# EAGLE design iprobe (EAGLE 6.6.0)
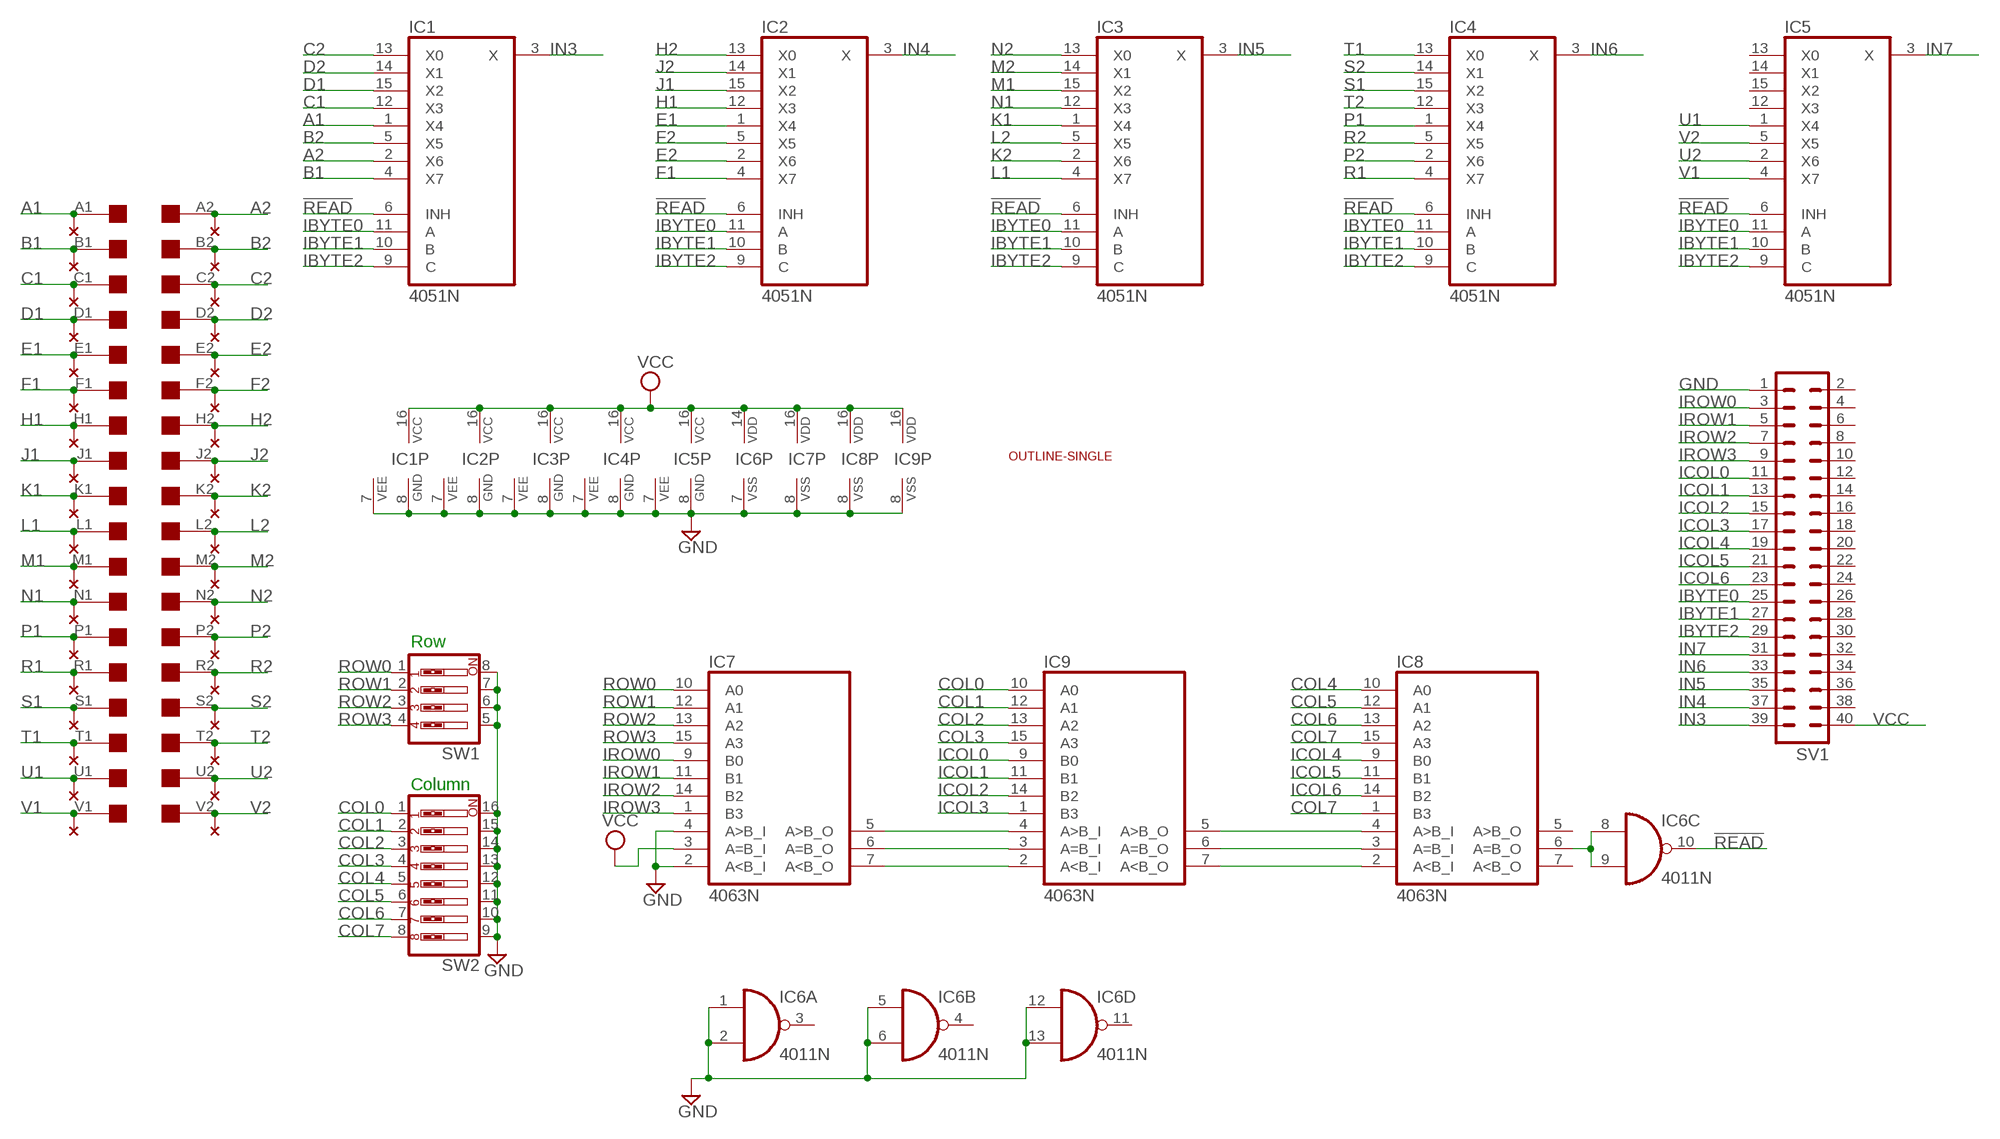
[diagram p0: schematic, sheet 1]

## Parts
EDGE1  EDGE-2CONNECTOR  [EDGE-CON2]
IC1  4051N  [DIL16]
IC2  4051N  [DIL16]
IC3  4051N  [DIL16]
IC4  4051N  [DIL16]
IC5  4051N  [DIL16]
IC6  4011N  [DIL14]
IC7  4063N  [DIL16]
IC8  4063N  [DIL16]
IC9  4063N  [DIL16]
SV1  MA20-2  [MA20-2]
SW1  SW_DIP-4  [EDG-04]
SW2  SW_DIP-8  [EDG-08]
U$2  THRU-HOLE2  [THRU-HOLEB]
U$3  OUTLINE-SINGLE  [SINGLE]

## Nets
!READ: IC1.6(INH) IC2.6(INH) IC3.6(INH) IC4.6(INH) IC5.6(INH) IC6.10(C:O)
A1: EDGE1.A1 IC1.1(X4) U$2.A1
A2: EDGE1.A2 IC1.2(X6) U$2.A2
B1: EDGE1.B1 IC1.4(X7) U$2.B1
B2: EDGE1.B2 IC1.5(X5) U$2.B2
C1: EDGE1.C1 IC1.12(X3) U$2.C1
C2: EDGE1.C2 IC1.13(X0) U$2.C2
COL0: IC9.10(A0) SW2.1
COL1: IC9.12(A1) SW2.2
COL2: IC9.13(A2) SW2.3
COL3: IC9.15(A3) SW2.4
COL4: IC8.10(A0) SW2.5
COL5: IC8.12(A1) SW2.6
COL6: IC8.13(A2) SW2.7
COL7: IC8.1(B3) IC8.15(A3) SW2.8
D1: EDGE1.D1 IC1.15(X2) U$2.D1
D2: EDGE1.D2 IC1.14(X1) U$2.D2
E1: EDGE1.E1 IC2.1(X4) U$2.E1
E2: EDGE1.E2 IC2.2(X6) U$2.E2
F1: EDGE1.F1 IC2.4(X7) U$2.F1
F2: EDGE1.F2 IC2.5(X5) U$2.F2
GND: IC1.7(VEE) IC1.8(GND) IC2.7(VEE) IC2.8(GND) IC3.7(VEE) IC3.8(GND) IC4.7(VEE) IC4.8(GND) IC5.7(VEE) IC5.8(GND) IC6.1(A:I0) IC6.2(A:I1) IC6.5(B:I0) IC6.6(B:I1) IC6.7(P:VSS) IC6.12(D:I0) IC6.13(D:I1) IC7.2(A<B_I) IC7.4(A>B_I) IC7.8(VSS) IC8.8(VSS) IC9.8(VSS) SV1.1 SW1.5 SW1.6 SW1.7 SW1.8 SW2.9 SW2.10 SW2.11 SW2.12 SW2.13 SW2.14 SW2.15 SW2.16
H1: EDGE1.H1 IC2.12(X3) U$2.H1
H2: EDGE1.H2 IC2.13(X0) U$2.H2
IBYTE0: IC1.11(A) IC2.11(A) IC3.11(A) IC4.11(A) IC5.11(A) SV1.25
IBYTE1: IC1.10(B) IC2.10(B) IC3.10(B) IC4.10(B) IC5.10(B) SV1.27
IBYTE2: IC1.9(C) IC2.9(C) IC3.9(C) IC4.9(C) IC5.9(C) SV1.29
ICOL0: IC9.9(B0) SV1.11
ICOL1: IC9.11(B1) SV1.13
ICOL2: IC9.14(B2) SV1.15
ICOL3: IC9.1(B3) SV1.17
ICOL4: IC8.9(B0) SV1.19
ICOL5: IC8.11(B1) SV1.21
ICOL6: IC8.14(B2) SV1.23
IN3: IC1.3(X) SV1.39
IN4: IC2.3(X) SV1.37
IN5: IC3.3(X) SV1.35
IN6: IC4.3(X) SV1.33
IN7: IC5.3(X) SV1.31
IROW0: IC7.9(B0) SV1.3
IROW1: IC7.11(B1) SV1.5
IROW2: IC7.14(B2) SV1.7
IROW3: IC7.1(B3) SV1.9
J1: EDGE1.J1 IC2.15(X2) U$2.J1
J2: EDGE1.J2 IC2.14(X1) U$2.J2
K1: EDGE1.K1 IC3.1(X4) U$2.K1
K2: EDGE1.K2 IC3.2(X6) U$2.K2
L1: EDGE1.L1 IC3.4(X7) U$2.L1
L2: EDGE1.L2 IC3.5(X5) U$2.L2
M1: EDGE1.M1 IC3.15(X2) U$2.M1
M2: EDGE1.M2 IC3.14(X1) U$2.M2
N1: EDGE1.N1 IC3.12(X3) U$2.N1
N2: EDGE1.N2 IC3.13(X0) U$2.N2
N$1: IC7.5(A>B_O) IC9.4(A>B_I)
N$2: IC7.6(A=B_O) IC9.3(A=B_I)
N$3: IC7.7(A<B_O) IC9.2(A<B_I)
N$4: IC6.8(C:I0) IC6.9(C:I1) IC8.6(A=B_O)
N$5: IC8.4(A>B_I) IC9.5(A>B_O)
N$6: IC8.3(A=B_I) IC9.6(A=B_O)
N$7: IC8.2(A<B_I) IC9.7(A<B_O)
P1: EDGE1.P1 IC4.1(X4) U$2.P1
P2: EDGE1.P2 IC4.2(X6) U$2.P2
R1: EDGE1.R1 IC4.4(X7) U$2.R1
R2: EDGE1.R2 IC4.5(X5) U$2.R2
ROW0: IC7.10(A0) SW1.1
ROW1: IC7.12(A1) SW1.2
ROW2: IC7.13(A2) SW1.3
ROW3: IC7.15(A3) SW1.4
S1: EDGE1.S1 IC4.15(X2) U$2.S1
S2: EDGE1.S2 IC4.14(X1) U$2.S2
T1: EDGE1.T1 IC4.13(X0) U$2.T1
T2: EDGE1.T2 IC4.12(X3) U$2.T2
U1: EDGE1.U1 IC5.1(X4) U$2.U1
U2: EDGE1.U2 IC5.2(X6) U$2.U2
V1: EDGE1.V1 IC5.4(X7) U$2.V1
V2: EDGE1.V2 IC5.5(X5) U$2.V2
VCC: IC1.16(VCC) IC2.16(VCC) IC3.16(VCC) IC4.16(VCC) IC5.16(VCC) IC6.14(P:VDD) IC7.3(A=B_I) IC7.16(VDD) IC8.16(VDD) IC9.16(VDD) SV1.40
Unconnected: IC5.12(X3) IC5.13(X0) IC5.14(X1) IC5.15(X2) IC6.3(A:O) IC6.4(B:O) IC6.11(D:O) IC8.5(A>B_O) IC8.7(A<B_O) SV1.2 SV1.4 SV1.6 SV1.8 SV1.10 SV1.12 SV1.14 SV1.16 SV1.18 SV1.20 SV1.22 SV1.24 SV1.26 SV1.28 SV1.30 SV1.32 SV1.34 SV1.36 SV1.38

## Notes on the sheet
- Row
- Column

## Library data of the parts
EDGE1 = dec-con:EDGE-2: Double-Sided DEC edge connector.
IC1-IC5 = 40xx:4051: 8-channel ANALOG MULTIPLEXER
IC6 = 40xx:4011: Quad 2-input NAND
IC7-IC9 = 40xx:4063: 4-bit magnitude COMPARATOR
SV1 = con-lstb:MA20-2: PIN HEADER; OC_FARNELL: unknown; OC_NEWARK: unknown
SW1 = special:SW_DIP-4: DIP SWITCH
SW2 = special:SW_DIP-8: DIP SWITCH
U$2 = dec-con:THRU-HOLE2: Thru-Hole addition to double-sided edge connector.
U$3 = dec-con:OUTLINE-*: Board outlines for DEC boards.

## Board
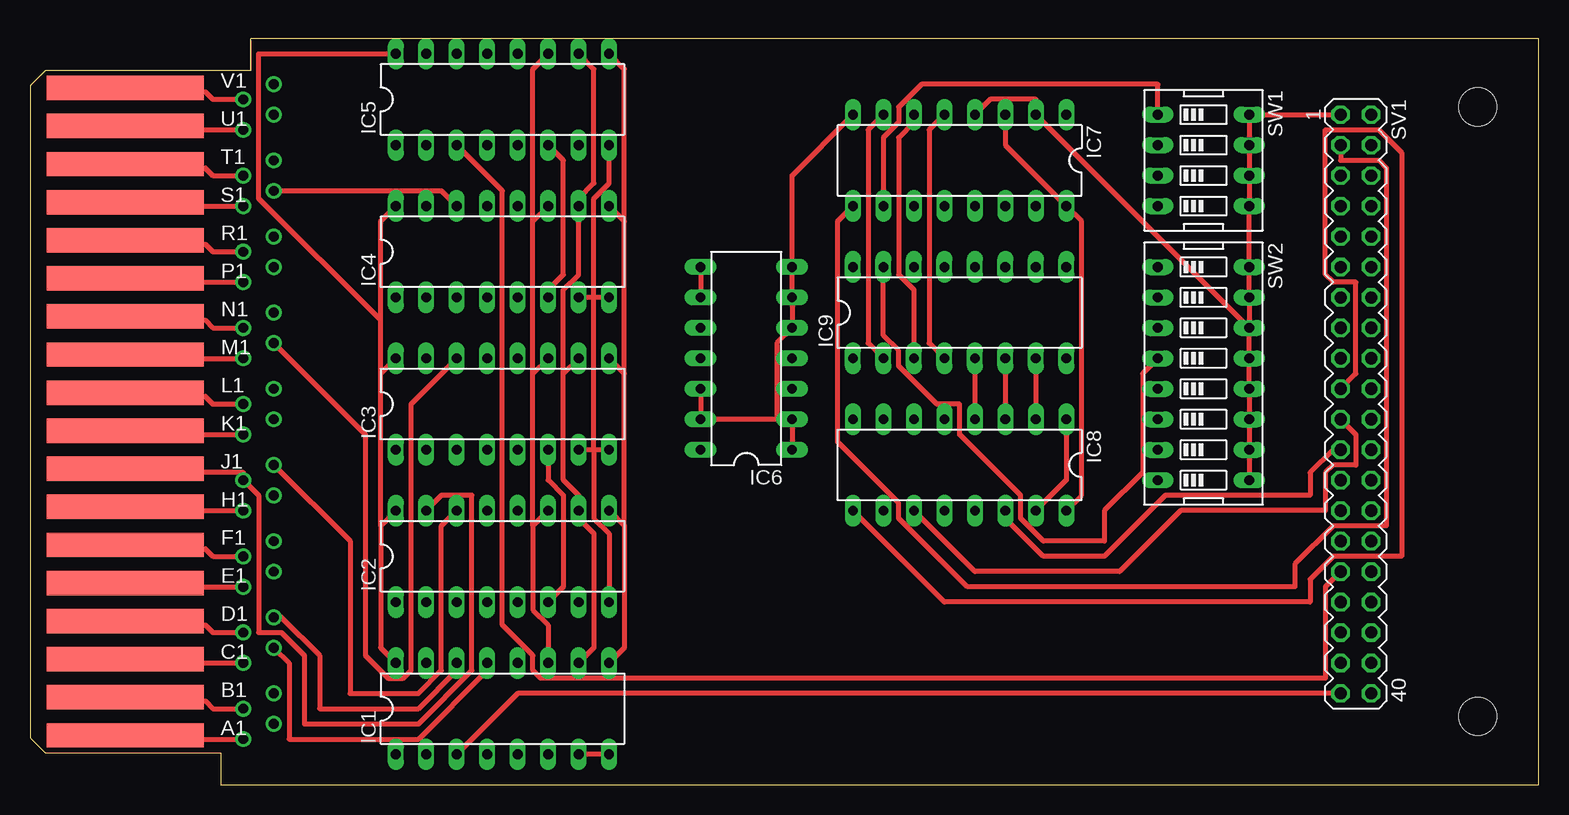
[diagram p1: board, top side]
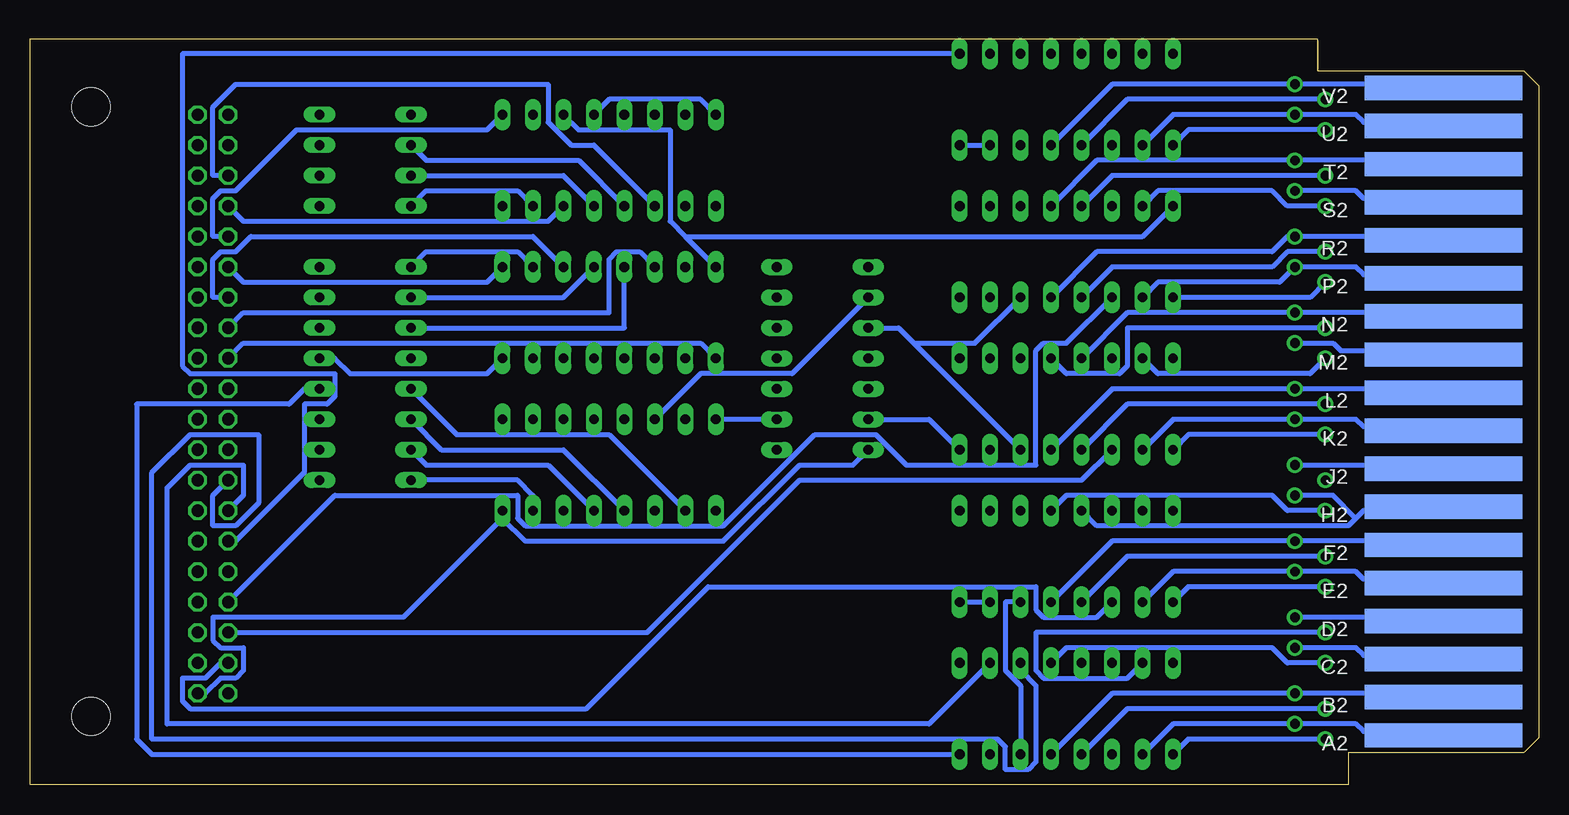
[diagram p2: board, bottom side, seen from below]

Size 125.73 x 62.23 mm. Coordinates in mm from the lower left corner, seen from the top.
Copper layers (1+16): Top 0.035mm / dielectric 1.5mm / Bottom 0.035mm
Design rules "16mils": minimum track width 16mil, minimum drill 32mil, track to track 15mil, track to pad 10mil, pad to pad 10mil, via to via 10mil, smd to smd 10mil, copper to edge 13mil, drill to drill 10mil, minimum pad ring 10mil, minimum via ring 8mil, stop-mask expansion 0mil, vias tented up to drill 0mil, thermal gap 10mil

### Footprints (pad centres in the part's own frame; a part is rotated, then mirrored left to right if it is on the bottom)
EDGE-CON2 = smd 13.106 x 2.032: A1 7.938,4.128; B1 7.938,7.303; C1 7.938,10.477; D1 7.938,13.652; E1 7.938,16.828; F1 7.938,20.003; H1 7.938,23.177; J1 7.938,26.352; K1 7.938,29.527; L1 7.938,32.703; M1 7.938,35.877; N1 7.938,39.053; P1 7.938,42.227; R1 7.938,45.403; S1 7.938,48.578; T1 7.938,51.752; U1 7.938,54.928; V1 7.938,58.102 | smd 13.106 x 2.032 bottom: A2 7.938,4.128; B2 7.938,7.303; C2 7.938,10.477; D2 7.938,13.652; E2 7.938,16.828; F2 7.938,20.003; H2 7.938,23.177; J2 7.938,26.352; K2 7.938,29.527; L2 7.938,32.703; M2 7.938,35.877; N2 7.938,39.053; P2 7.938,42.227; R2 7.938,45.403; S2 7.938,48.578; T2 7.938,51.752; U2 7.938,54.928; V2 7.938,58.102
DIL16 = drill 0.813 long: 1 -8.89,-3.81; 2 -6.35,-3.81; 3 -3.81,-3.81; 4 -1.27,-3.81; 5 1.27,-3.81; 6 3.81,-3.81; 7 6.35,-3.81; 8 8.89,-3.81; 9 8.89,3.81; 10 6.35,3.81; 11 3.81,3.81; 12 1.27,3.81; 13 -1.27,3.81; 14 -3.81,3.81; 15 -6.35,3.81; 16 -8.89,3.81
DIL14 = drill 0.813 long: 1 -7.62,-3.81; 2 -5.08,-3.81; 3 -2.54,-3.81; 4 0,-3.81; 5 2.54,-3.81; 6 5.08,-3.81; 7 7.62,-3.81; 8 7.62,3.81; 9 5.08,3.81; 10 2.54,3.81; 11 0,3.81; 12 -2.54,3.81; 13 -5.08,3.81; 14 -7.62,3.81
MA20-2 = drill 1.016 octagon: 1 -24.13,-1.27; 2 -24.13,1.27; 3 -21.59,-1.27; 4 -21.59,1.27; 5 -19.05,-1.27; 6 -19.05,1.27; 7 -16.51,-1.27; 8 -16.51,1.27; 9 -13.97,-1.27; 10 -13.97,1.27; 11 -11.43,-1.27; 12 -11.43,1.27; 13 -8.89,-1.27; 14 -8.89,1.27; 15 -6.35,-1.27; 16 -6.35,1.27; 17 -3.81,-1.27; 18 -3.81,1.27; 19 -1.27,-1.27; 20 -1.27,1.27; 21 1.27,-1.27; 22 1.27,1.27; 23 3.81,-1.27; 24 3.81,1.27; 25 6.35,-1.27; 26 6.35,1.27; 27 8.89,-1.27; 28 8.89,1.27; 29 11.43,-1.27; 30 11.43,1.27; 31 13.97,-1.27; 32 13.97,1.27; 33 16.51,-1.27; 34 16.51,1.27; 35 19.05,-1.27; 36 19.05,1.27; 37 21.59,-1.27; 38 21.59,1.27; 39 24.13,-1.27; 40 24.13,1.27
EDG-04 = drill 0.813 long: 1 -3.81,-3.81; 2 -1.27,-3.81; 3 1.27,-3.81; 4 3.81,-3.81; 5 3.81,3.81; 6 1.27,3.81; 7 -1.27,3.81; 8 -3.81,3.81
EDG-08 = drill 0.813 long: 1 -8.89,-3.81; 2 -6.35,-3.81; 3 -3.81,-3.81; 4 -1.27,-3.81; 5 1.27,-3.81; 6 3.81,-3.81; 7 6.35,-3.81; 8 8.89,-3.81; 9 8.89,3.81; 10 6.35,3.81; 11 3.81,3.81; 12 1.27,3.81; 13 -1.27,3.81; 14 -3.81,3.81; 15 -6.35,3.81; 16 -8.89,3.81
THRU-HOLEB = drill 0.813 pad 1.27: A1 17.78,3.81; A2 20.32,5.08; B1 17.78,6.35; B2 20.32,7.62; C1 17.78,10.16; C2 20.32,11.43; D1 17.78,12.7; D2 20.32,13.97; E1 17.78,16.51; E2 20.32,17.78; F1 17.78,19.05; F2 20.32,20.32; H1 17.78,22.86; H2 20.32,24.13; J1 17.78,25.4; J2 20.32,26.67; K1 17.78,29.21; K2 20.32,30.48; L1 17.78,31.75; L2 20.32,33.02; M1 17.78,35.56; M2 20.32,36.83; N1 17.78,38.1; N2 20.32,39.37; P1 17.78,41.91; P2 20.32,43.18; R1 17.78,44.45; R2 20.32,45.72; S1 17.78,48.26; S2 20.32,49.53; T1 17.78,50.8; T2 20.32,52.07; U1 17.78,54.61; U2 20.32,55.88; V1 17.78,57.15; V2 20.32,58.42
SINGLE = hole 3.175: 120.65,56.515; 120.65,5.715

### Placement (x,y rotation side)
EDGE1  0,0 0 top
IC1  39.37,6.35 0 top
IC2  39.37,19.05 0 top
IC3  39.37,31.75 0 top
IC4  39.37,44.45 0 top
IC5  39.37,57.15 0 top
IC6  59.69,35.56 90 top
IC7  77.47,52.07 180 top
IC8  77.47,26.67 180 top
IC9  77.47,39.37 0 top
SV1  110.49,31.75 270 top
SW1  97.79,52.07 270 top
SW2  97.79,34.29 270 top
U$2  0,0 0 top
U$3  0,0 0 top

### Tracks (layer width: path | path; a pad name or v marks a point on that pad's centre or on a via)
!READ
  Top 0.406: IC5.6 44.45,52.07 44.45,42.55 43.18,41.27 IC4.6 | IC2.6 44.45,16.51 44.45,24.13 43.18,25.4 IC3.6
  Bottom 0.406: IC1.6 43.18,8.26 44.45,9.53 44.45,15.24 IC2.6 | 52.07,36.83 53.34,38.1 IC6.10 | 52.07,36.83 IC3.6 | IC4.6 46.99,36.83 52.07,36.83
A1
  Top 0.406: U$2.A1 8.26,3.81 EDGE1.A1
  Bottom 0.406: IC1.1 29.21,3.81 U$2.A1
A2
  Bottom 0.406: IC1.2 30.48,5.08 U$2.A2 15.24,5.08 14.61,4.45 8.26,4.45 EDGE1.A2
B1
  Top 0.406: U$2.B1 15.24,6.35 14.61,6.99 8.26,6.99 EDGE1.B1
  Bottom 0.406: IC1.4 34.29,6.35 U$2.B1
B2
  Bottom 0.406: IC1.5 35.56,7.62 U$2.B2 8.26,7.62 EDGE1.B2
C1
  Top 0.406: U$2.C1 8.26,10.16 EDGE1.C1
  Bottom 0.406: IC1.12 39.37,11.43 22.23,11.43 20.96,10.16 U$2.C1
C2
  Top 0.406: IC1.13 38.1,9.53 32.39,3.81 21.59,3.81 21.59,10.16 U$2.C2
  Bottom 0.406: U$2.C2 15.24,11.43 14.61,10.79 8.26,10.79 EDGE1.C2
COL0
  Bottom 0.406: IC9.10 85.09,44.45 92.71,44.45 SW2.1
COL1
  Bottom 0.406: IC9.12 81.28,40.64 SW2.2
COL2
  Bottom 0.406: IC9.13 76.2,38.1 SW2.3
COL3
  Top 0.406: IC9.15 71.12,37.47 72.39,36.2 72.39,34.92 75.57,31.75 77.47,31.75 77.47,29.21 82.55,24.13 82.55,22.23 84.46,20.32 89.54,20.32 89.54,22.86 92.71,26.04 92.71,34.29 SW2.4
COL4
  Bottom 0.406: IC8.10 77.47,29.21 90.17,29.21 SW2.5
COL5
  Bottom 0.406: IC8.12 81.28,27.94 91.44,27.94 SW2.6
COL6
  Bottom 0.406: IC8.13 82.55,26.67 92.71,26.67 SW2.7
COL7
  Top 0.406: IC8.15 86.36,25.4 IC8.1
  Bottom 0.406: SW2.8 85.09,25.4 83.82,24.13 IC8.15
D1
  Top 0.406: U$2.D1 15.24,12.7 14.61,13.34 8.26,13.34 EDGE1.D1
  Bottom 0.406: IC1.15 34.29,8.89 41.28,8.89 41.91,9.53 41.91,12.7 U$2.D1
D2
  Top 0.406: IC1.14 35.56,9.53 32.39,6.35 24.13,6.35 24.13,10.79 20.96,13.97 U$2.D2
  Bottom 0.406: U$2.D2 8.26,13.97 EDGE1.D2
E1
  Top 0.406: U$2.E1 8.26,16.51 EDGE1.E1
  Bottom 0.406: IC2.1 29.21,16.51 U$2.E1
E2
  Bottom 0.406: IC2.2 30.48,17.78 U$2.E2 15.24,17.78 14.61,17.14 8.26,17.14 EDGE1.E2
F1
  Top 0.406: U$2.F1 15.24,19.05 14.61,19.68 8.26,19.68 EDGE1.F1
  Bottom 0.406: IC2.4 34.29,19.05 U$2.F1
F2
  Bottom 0.406: IC2.5 35.56,20.32 U$2.F2 8.26,20.32 EDGE1.F2
GND
  Top 0.406: IC4.8 46.99,40.64 | 46.99,40.64 IC4.7 | IC3.8 46.99,27.94 | 46.99,27.94 IC3.7 | IC2.8 48.26,20.95 46.99,22.23 46.99,27.94 | 46.99,27.94 46.99,40.64 | IC5.8 48.26,50.16 46.99,48.9 46.99,40.64 | IC6.12 IC6.13 62.23,30.48 | IC6.1 IC6.2 62.23,30.48 | IC7.4 80.01,57.15 83.82,57.15 IC7.2 SW2.14 | IC7.8 63.5,50.8 IC6.7 IC6.6 IC6.5 62.23,36.83 62.23,30.48 | SV1.1 SW1.8 SW1.7 SW1.6 SW1.5 SW2.16 SW2.15 SW2.14 | SW2.14 SW2.13 SW2.12 SW2.11 SW2.10 SW2.9 | IC1.8 IC1.7
  Bottom 0.406: IC5.8 IC5.7 | IC2.8 IC2.7 | IC6.2 IC8.8 | IC7.4 77.47,57.15 69.85,57.15 IC7.8 | IC3.8 50.8,30.48 IC6.13 | IC9.8 87.63,34.29 99.06,34.29 100.33,35.56 SW2.13 | IC1.8 115.57,2.54 116.84,3.81 116.84,31.75 104.14,31.75 102.87,33.02 SW2.12
H1
  Top 0.406: U$2.H1 8.26,22.86 EDGE1.H1
  Bottom 0.406: IC2.12 39.37,24.13 22.23,24.13 20.96,22.86 U$2.H1
H2
  Bottom 0.406: IC2.13 36.83,21.59 15.88,21.59 15.24,22.23 | 15.24,22.23 14.61,22.86 8.26,22.86 EDGE1.H2 | U$2.H2 17.15,24.13 15.24,22.23
IBYTE0
  Top 0.406: IC1.11 43.18,13.34 41.91,14.61 41.91,21.59 | IC2.11 41.91,21.59 | 41.91,34.29 IC3.11 | 41.91,21.59 41.91,34.29 | 41.91,46.99 IC4.11 | 41.91,34.29 41.91,46.99 | IC5.11 41.91,59.69 41.91,46.99
  Bottom 0.406: SV1.25 110.49,24.13 110.49,21.59 108.59,21.59 106.68,23.5 106.68,29.21 112.4,29.21 115.57,26.04 115.57,3.81 45.09,3.81 44.45,3.17 44.45,1.27 42.55,1.27 41.91,1.91 41.91,8.26 43.18,9.53 IC1.11
IBYTE1
  Top 0.406: IC1.10 46.99,11.43 46.99,20.95 45.72,22.23 IC2.10 45.72,24.13 44.45,25.4 44.45,34.29 | 44.45,34.29 IC3.10 | 44.45,34.29 44.45,41.27 45.72,42.55 IC4.10 45.72,48.9 46.99,50.16 46.99,59.69 IC5.10
  Bottom 0.406: SV1.27 107.95,24.13 107.95,26.67 112.4,26.67 114.3,24.77 114.3,5.08 50.8,5.08 IC1.10
IBYTE2
  Top 0.406: IC1.9 49.53,11.43 49.53,21.59 | IC2.9 49.53,21.59 | 49.53,34.29 IC3.9 | 49.53,21.59 49.53,34.29 | 49.53,46.99 IC4.9 | 49.53,34.29 49.53,46.99 | IC5.9 49.53,59.69 49.53,46.99
  Bottom 0.406: SV1.29 108.59,20.32 102.87,26.04 102.87,31.75 100.97,31.75 100.33,32.38 100.33,34.29 112.4,34.29 113.03,34.92 113.03,60.96 IC5.9
ICOL0
  Bottom 0.406: IC9.9 87.63,41.91 107.95,41.91 SV1.11
ICOL1
  Bottom 0.406: IC9.11 83.82,45.72 107.32,45.72 108.59,44.45 109.86,44.45 110.49,43.81 110.49,40.64 SV1.13
ICOL2
  Bottom 0.406: IC9.14 74.93,44.45 76.84,44.45 77.47,43.81 77.47,39.37 107.95,39.37 SV1.15
ICOL3
  Bottom 0.406: IC9.1 69.85,36.83 107.95,36.83 SV1.17
ICOL4
  Top 0.406: IC8.9 76.2,15.24 106.68,15.24 106.68,17.14 108.59,19.05 114.3,19.05 114.3,52.7 112.4,54.61 107.95,54.61 107.95,42.55 108.59,41.91 110.49,41.91 110.49,34.29 SV1.19
ICOL5
  Top 0.406: IC8.11 78.74,17.78 90.81,17.78 95.89,22.86 107.95,22.86 107.95,26.04 108.59,26.67 110.49,26.67 110.49,29.21 SV1.21
ICOL6
  Top 0.406: IC8.14 81.28,22.23 84.46,19.05 89.54,19.05 94.62,24.13 106.68,24.13 106.68,26.04 108.59,27.94 SV1.23
IN3
  Top 0.406: IC1.3 40.64,7.62 SV1.39
IN4
  Bottom 0.406: IC2.3 36.83,13.97 41.28,13.97 41.91,14.61 41.91,16.51 69.22,16.51 79.38,6.35 112.4,6.35 113.03,6.99 113.03,8.89 111.13,8.89 109.86,10.16 SV1.37
IN5
  Bottom 0.406: IC3.3 38.1,25.4 61.6,25.4 74.3,12.7 SV1.35
IN6
  Bottom 0.406: IC4.3 39.37,36.83 41.28,36.83 41.91,36.2 41.91,26.67 52.71,26.67 55.25,29.21 60.33,29.21 67.95,21.59 84.46,21.59 85.09,22.23 85.09,24.13 100.33,24.13 SV1.33
IN7
  Top 0.406: IC5.3 39.37,49.53 39.37,13.34 41.91,10.79 41.91,9.53 42.55,8.89 107.95,8.89 107.95,16.51 SV1.31
IROW0
  Top 0.406: IC7.9 67.31,46.99 67.31,28.57 72.39,23.5 72.39,22.23 78.11,16.51 105.41,16.51 105.41,18.41 108.59,21.59 113.03,21.59 113.03,51.44 112.4,52.07 109.22,52.07 SV1.3
IROW1
  Bottom 0.406: IC7.11 78.74,53.34 80.65,53.34 82.55,55.24 82.55,58.42 108.59,58.42 110.49,56.52 110.49,50.8 SV1.5
IROW2
  Bottom 0.406: IC7.14 82.55,46.99 107.95,46.99 SV1.7
IROW3
  Bottom 0.406: IC7.1 87.63,54.61 103.51,54.61 108.59,49.53 109.86,49.53 110.49,48.9 110.49,45.72 SV1.9
J1
  Top 0.406: IC2.15 34.29,24.13 36.83,24.13 36.83,9.53 32.39,5.08 22.86,5.08 22.86,10.79 20.96,12.7 19.05,12.7 19.05,24.13 U$2.J1 17.78,26.04 8.26,26.04 EDGE1.J1
J2
  Top 0.406: IC2.14 34.29,21.59 34.29,9.53 32.39,7.62 26.67,7.62 26.67,20.32 U$2.J2
  Bottom 0.406: U$2.J2 8.26,26.67 EDGE1.J2
K1
  Top 0.406: U$2.K1 8.26,29.21 EDGE1.K1
  Bottom 0.406: IC3.1 29.21,29.21 U$2.K1
K2
  Bottom 0.406: IC3.2 30.48,30.48 U$2.K2 15.24,30.48 14.61,29.84 8.26,29.84 EDGE1.K2
L1
  Top 0.406: U$2.L1 15.24,31.75 14.61,32.38 8.26,32.38 EDGE1.L1
  Bottom 0.406: IC3.4 34.29,31.75 U$2.L1
L2
  Bottom 0.406: IC3.5 35.56,33.02 U$2.L2 8.26,33.02 EDGE1.L2
M1
  Top 0.406: U$2.M1 8.26,35.56 EDGE1.M1
  Bottom 0.406: IC3.15 31.75,34.29 19.05,34.29 U$2.M1
M2
  Top 0.406: IC3.14 31.75,31.75 31.75,9.53 31.12,8.89 29.85,8.89 27.94,10.79 27.94,29.21 U$2.M2
  Bottom 0.406: U$2.M2 17.15,36.83 16.51,36.2 8.26,36.2 EDGE1.M2
N1
  Top 0.406: U$2.N1 15.24,38.1 14.61,38.73 8.26,38.73 EDGE1.N1
  Bottom 0.406: IC3.12 39.37,34.29 34.93,34.29 34.29,34.92 34.29,38.1 U$2.N1
N2
  Bottom 0.406: IC3.13 34.29,39.37 U$2.N2 8.26,39.37 EDGE1.N2
N$1
  Top 0.406: IC9.4 74.93,36.83 74.93,54.61 IC7.5
N$2
  Top 0.406: IC9.3 73.66,41.27 72.39,42.55 72.39,53.98 73.66,55.24 IC7.6
N$3
  Top 0.406: IC9.2 69.85,36.83 69.85,54.61 IC7.7
N$4
  Top 0.406: IC6.8 IC6.9
  Bottom 0.406: IC8.6 69.85,34.29 62.23,34.29 IC6.9
N$5
  Top 0.406: IC9.5 IC8.4
N$6
  Top 0.406: IC9.6 IC8.3
N$7
  Top 0.406: IC9.7 IC8.2
P1
  Top 0.406: U$2.P1 8.26,41.91 EDGE1.P1
  Bottom 0.406: IC4.1 19.05,40.64 U$2.P1
P2
  Bottom 0.406: IC4.2 31.75,41.91 21.59,41.91 U$2.P2 15.24,43.18 14.61,42.55 8.26,42.55 EDGE1.P2
R1
  Top 0.406: U$2.R1 15.24,44.45 14.61,45.09 8.26,45.09 EDGE1.R1
  Bottom 0.406: IC4.4 35.56,43.18 22.23,43.18 20.96,44.45 U$2.R1
R2
  Bottom 0.406: IC4.5 36.83,44.45 22.23,44.45 20.96,45.72 U$2.R2 8.26,45.72 EDGE1.R2
ROW0
  Top 0.406: IC7.10 71.12,53.98 72.39,55.24 72.39,56.52 74.3,58.42 93.98,58.42 SW1.1
ROW1
  Bottom 0.406: IC7.12 80.01,52.07 92.71,52.07 SW1.2
ROW2
  Bottom 0.406: IC7.13 81.28,50.8 SW1.3
ROW3
  Bottom 0.406: IC7.15 85.09,49.53 92.71,49.53 SW1.4
S1
  Top 0.406: U$2.S1 8.26,48.26 EDGE1.S1
  Bottom 0.406: IC4.15 31.75,49.53 22.23,49.53 20.96,48.26 U$2.S1
S2
  Top 0.406: IC4.14 34.29,49.53 U$2.S2
  Bottom 0.406: U$2.S2 15.24,49.53 14.61,48.9 8.26,48.9 EDGE1.S2
T1
  Top 0.406: U$2.T1 15.24,50.8 14.61,51.44 8.26,51.44 EDGE1.T1
  Bottom 0.406: IC4.13 35.56,50.8 U$2.T1
T2
  Bottom 0.406: IC4.12 36.83,52.07 U$2.T2 8.26,52.07 EDGE1.T2
U1
  Top 0.406: U$2.U1 8.26,54.61 EDGE1.U1
  Bottom 0.406: IC5.1 29.21,54.61 U$2.U1
U2
  Bottom 0.406: IC5.2 30.48,55.88 U$2.U2 15.24,55.88 14.61,55.24 8.26,55.24 EDGE1.U2
V1
  Top 0.406: U$2.V1 15.24,57.15 14.61,57.78 8.26,57.78 EDGE1.V1
  Bottom 0.406: IC5.4 34.29,57.15 U$2.V1
V2
  Bottom 0.406: IC5.5 35.56,58.42 U$2.V2 8.26,58.42 EDGE1.V2
VCC
  Top 0.406: IC1.16 29.21,11.43 29.21,21.59 | IC2.16 29.21,21.59 | 29.21,34.29 IC3.16 | 29.21,21.59 29.21,34.29 | IC4.16 29.21,46.99 29.21,38.73 | 29.21,34.29 29.21,38.73 | IC5.16 19.05,60.96 19.05,48.9 29.21,38.73 | IC7.3 81.28,53.34 IC7.16 87.63,46.99 87.63,24.13 IC8.16
  Bottom 0.406: 71.12,45.72 72.39,46.99 72.39,54.61 80.01,54.61 IC7.3 | 71.12,45.72 IC9.16 | IC6.14 57.15,26.67 61.6,26.67 67.95,20.32 84.46,20.32 86.36,22.23 | SV1.40 111.13,7.62 109.86,8.89 108.59,8.89 107.95,9.53 107.95,11.43 109.86,11.43 110.49,12.06 110.49,13.97 94.62,13.97 86.36,22.23 | 86.36,22.23 IC8.16 | IC4.16 33.02,45.72 71.12,45.72